# EAGLE design Toggle Switch (EAGLE 9.4.2)
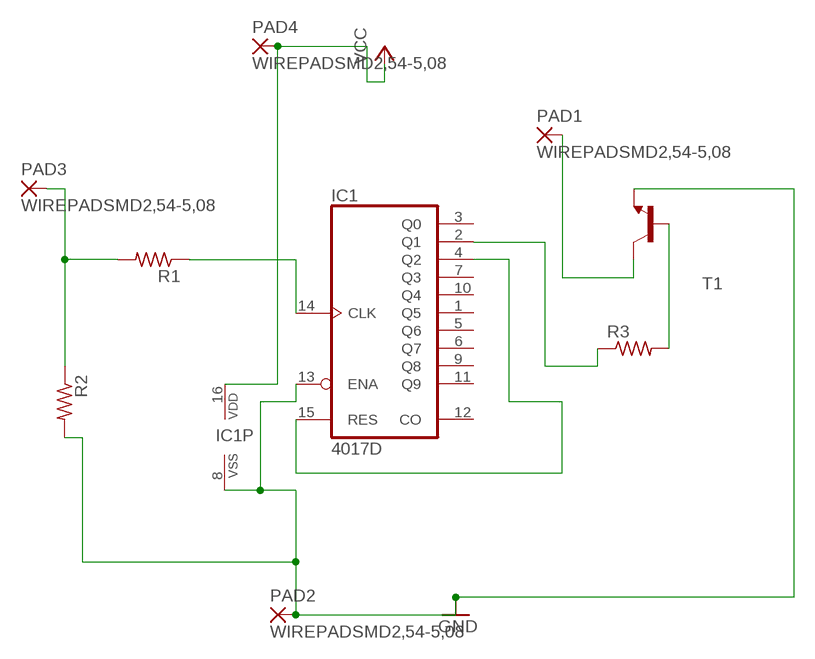
[diagram p0: schematic, sheet 1]

## Parts
IC1  4017D  [SO16]
PAD1  WIREPADSMD2,54-5,08  [SMD2,54-5,08]
PAD2  WIREPADSMD2,54-5,08  [SMD2,54-5,08]
PAD3  WIREPADSMD2,54-5,08  [SMD2,54-5,08]
PAD4  WIREPADSMD2,54-5,08  [SMD2,54-5,08]
R1  R-US_0207/7  [0207/7]
R2  R-US_0207/7  [0207/7]
R3  R-US_0207/7  [0207/7]
T1  BC639-NPN-TO92-ECB  [TO92-ECB]

## Nets
GND: IC1.8(VSS) IC1.13(ENA) PAD2.1(P) R2.2 T1.E
N$1: IC1.14(CLK) R1.1
N$2: PAD3.1(P) R1.2 R2.1
N$4: IC1.4(Q2) IC1.15(RES)
N$6: IC1.2(Q1) R3.1
N$7: R3.2 T1.B
N$9: PAD1.1(P) T1.C
VCC: IC1.16(VDD) PAD4.1(P)
Unconnected: IC1.1(Q5) IC1.3(Q0) IC1.5(Q6) IC1.6(Q7) IC1.7(Q3) IC1.9(Q8) IC1.10(Q4) IC1.11(Q9) IC1.12(CO)

## Library data of the parts
IC1 = 40xx:4017: COUNTER/DIVIDER
PAD1-PAD4 = wirepad:WIREPAD: Wire PAD connect wire on PCB
R1-R3 = resistor:R-US_: RESISTOR, American symbol
T1 = transistor:*-NPN-: NPN Transistror BF959 corrected 2008.03.06

## Board
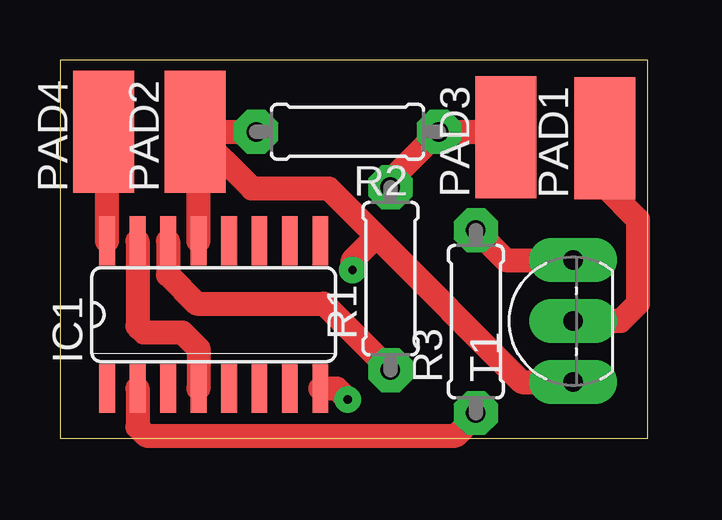
[diagram p1: board, top side]
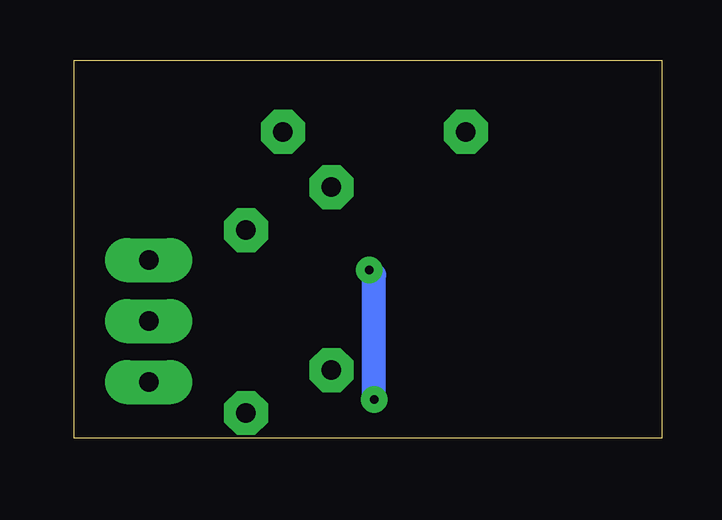
[diagram p2: board, bottom side, seen from below]

Size 24.5 x 15.75 mm. Coordinates in mm from the lower left corner, seen from the top.
Outline: 0,0 24.5,0 24.5,15.75 0,15.75 0,0
Copper layers (1*16): Top 0.035mm / dielectric 1.5mm / Bottom 0.035mm
Design rules "default *": minimum track width 0.7mm, minimum drill 0.35mm, track to track 0.3mm, track to pad 0.3mm, pad to pad 0.3mm, via to via 0.3mm, smd to smd 0.3mm, copper to edge 0.3mm, drill to drill 0.3mm, minimum pad ring 20mil, minimum via ring 15mil, stop-mask expansion 4mil, vias tented up to drill 0mil, thermal gap 10mil

### Footprints (pad centres in the part's own frame; a part is rotated, then mirrored left to right if it is on the bottom)
SO16 = smd 0.66 x 2.032: 1 -4.445,-3.073; 2 -3.175,-3.073; 3 -1.905,-3.073; 4 -0.635,-3.073; 5 0.635,-3.073; 6 1.905,-3.073; 7 3.175,-3.073; 8 4.445,-3.073; 9 4.445,3.073; 10 3.175,3.073; 11 1.905,3.073; 12 0.635,3.073; 13 -0.635,3.073; 14 -1.905,3.073; 15 -3.175,3.073; 16 -4.445,3.073
SMD2,54-5,08 = smd 2.54 x 5.08: 1 0,0
0207/7 = drill 0.813 octagon: 1 -3.81,0; 2 3.81,0
TO92-ECB = drill 0.813 long: B 2.54,0; C 0,0; E -2.54,0

### Placement (x,y rotation side)
IC1  6.41,5.14 0 top
PAD1  22.71,12.49 0 top
PAD2  5.64,12.76 0 top
PAD3  18.59,12.53 0 top
PAD4  1.83,12.76 0 top
R1  13.78,6.64 90 top
R2  11.99,12.76 180 top
R3  17.34,4.85 90 top
T1  21.4,4.87 90 top

### Tracks (layer width: path | path; a pad name or v marks a point on that pad's centre or on a via)
GND  (via drill 0.35)
  Top 1: 5.75,12.25 PAD2.1 | IC1.13 5.78,12.62 PAD2.1 | PAD2.1 R2.2 | PAD2.1 8,10.4 11.2,10.4 13.2,8.4 | T1.E 19.27,2.33 13.2,8.4 | IC1.8 11.53,2.07 v12,1.6 | v12.2,7 12.2,7.4 13.2,8.4
  Bottom 1: v12,1.6 12,6.8 v12.2,7
N$1
  Top 1: IC1.14 4.5,6.79 5.7,5.6 11.01,5.6 R1.1
N$2
  Top 1: 18.5,12.62 PAD3.1 18.36,12.76 R2.1 13.78,10.74 R1.2
N$4
  Top 1: IC1.15 3.23,4.67 3.5,4.4 5.1,4.4 5.78,3.73 IC1.4
N$6
  Top 1: IC1.2 3.23,0.47 3.6,0.1 16.5,0.1 17.34,0.94 R3.1
N$7
  Top 1: R3.2 18.59,7.41 T1.B
N$9
  Top 1: PAD1.1 22.71,10.49 24.1,9.1 24.1,5.6 23.37,4.87 T1.C
VCC
  Top 1: 1.88,12.75 PAD4.1 1.8,12.73 1.8,11.9 1.97,11.73 IC1.16